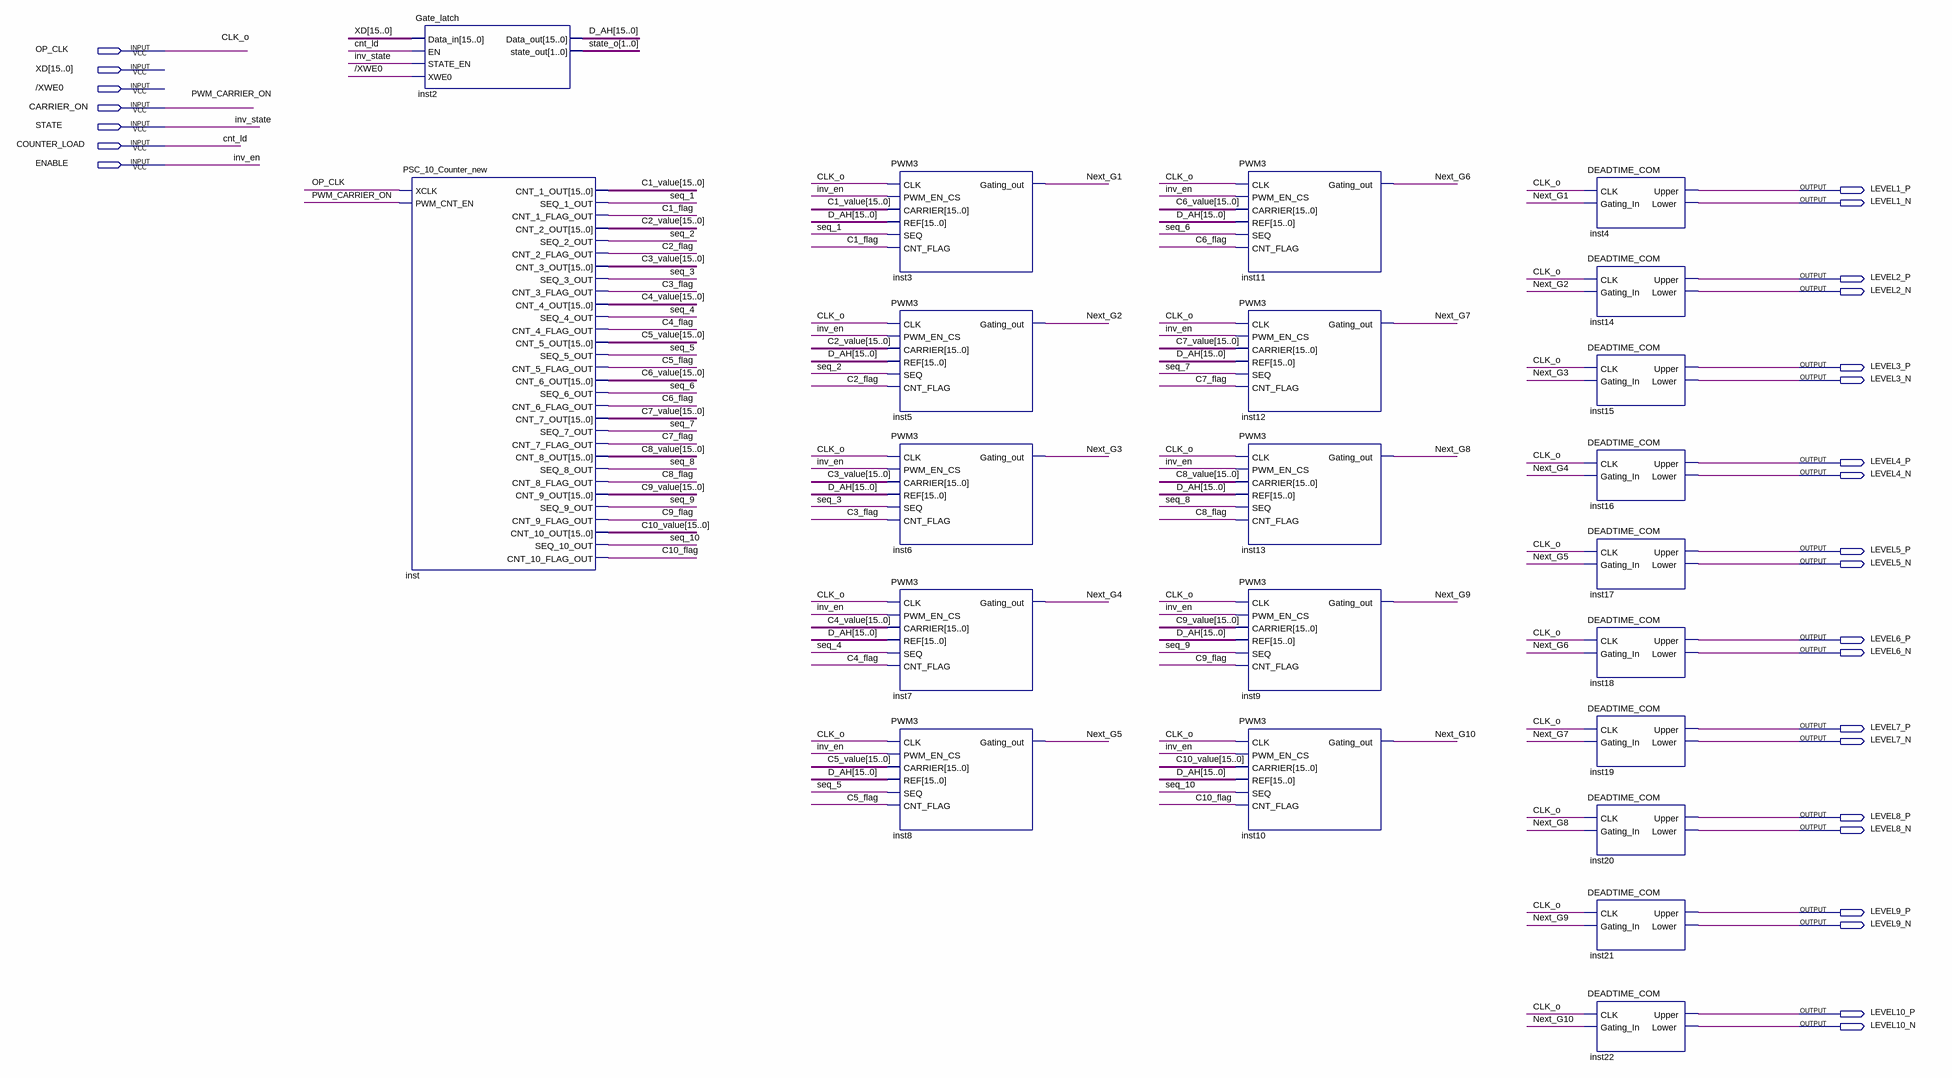
[diagram p0: schematic sheet]
// Quartus schematic INVERTER_LEVEL1.bdf as structural Verilog: 22 symbols, 27 pins
module INVERTER_LEVEL1 (
  input  OP_CLK,
  input  [15:0] XD,
  input  \/XWE0 ,
  input  CARRIER_ON,
  input  STATE,
  input  COUNTER_LOAD,
  input  ENABLE,
  output LEVEL1_P,
  output LEVEL1_N,
  output LEVEL2_P,
  output LEVEL2_N,
  output LEVEL3_P,
  output LEVEL3_N,
  output LEVEL4_P,
  output LEVEL4_N,
  output LEVEL5_P,
  output LEVEL5_N,
  output LEVEL6_P,
  output LEVEL6_N,
  output LEVEL7_P,
  output LEVEL7_N,
  output LEVEL8_P,
  output LEVEL8_N,
  output LEVEL9_P,
  output LEVEL9_N,
  output LEVEL10_P,
  output LEVEL10_N
);

  wire C1_flag, C2_flag, C3_flag, C4_flag, C5_flag, C6_flag, C7_flag, C8_flag, C9_flag, C10_flag, Next_G1,
       Next_G2, Next_G3, Next_G4, Next_G5, Next_G6, Next_G7, Next_G8, Next_G9, Next_G10, seq_1, seq_2, seq_3,
       seq_4, seq_5, seq_6, seq_7, seq_8, seq_9, seq_10;
  wire [1:0] state_o;
  wire [15:0] C1_value, C2_value, C3_value, C4_value, C5_value, C6_value, C7_value, C8_value, C9_value,
       C10_value, D_AH;

  Gate_latch inst2 (
    .Data_in(XD), .EN(COUNTER_LOAD), .STATE_EN(STATE), .XWE0(\/XWE0 ), .Data_out(D_AH), .state_out(state_o));
  PSC_10_Counter_new inst (
    .XCLK(OP_CLK), .PWM_CNT_EN(CARRIER_ON), .CNT_1_OUT(C1_value), .SEQ_1_OUT(seq_1),
    .CNT_1_FLAG_OUT(C1_flag), .CNT_2_OUT(C2_value), .SEQ_2_OUT(seq_2), .CNT_2_FLAG_OUT(C2_flag),
    .CNT_3_OUT(C3_value), .SEQ_3_OUT(seq_3), .CNT_3_FLAG_OUT(C3_flag), .CNT_4_OUT(C4_value),
    .SEQ_4_OUT(seq_4), .CNT_4_FLAG_OUT(C4_flag), .CNT_5_OUT(C5_value), .SEQ_5_OUT(seq_5),
    .CNT_5_FLAG_OUT(C5_flag), .CNT_6_OUT(C6_value), .SEQ_6_OUT(seq_6), .CNT_6_FLAG_OUT(C6_flag),
    .CNT_7_OUT(C7_value), .SEQ_7_OUT(seq_7), .CNT_7_FLAG_OUT(C7_flag), .CNT_8_OUT(C8_value),
    .SEQ_8_OUT(seq_8), .CNT_8_FLAG_OUT(C8_flag), .CNT_9_OUT(C9_value), .SEQ_9_OUT(seq_9),
    .CNT_9_FLAG_OUT(C9_flag), .CNT_10_OUT(C10_value), .SEQ_10_OUT(seq_10), .CNT_10_FLAG_OUT(C10_flag));
  PWM3 inst3 (
    .CLK(OP_CLK), .PWM_EN_CS(ENABLE), .CARRIER(C1_value), .REF(D_AH), .SEQ(seq_1), .CNT_FLAG(C1_flag),
    .Gating_out(Next_G1));
  PWM3 inst5 (
    .CLK(OP_CLK), .PWM_EN_CS(ENABLE), .CARRIER(C2_value), .REF(D_AH), .SEQ(seq_2), .CNT_FLAG(C2_flag),
    .Gating_out(Next_G2));
  PWM3 inst6 (
    .CLK(OP_CLK), .PWM_EN_CS(ENABLE), .CARRIER(C3_value), .REF(D_AH), .SEQ(seq_3), .CNT_FLAG(C3_flag),
    .Gating_out(Next_G3));
  PWM3 inst7 (
    .CLK(OP_CLK), .PWM_EN_CS(ENABLE), .CARRIER(C4_value), .REF(D_AH), .SEQ(seq_4), .CNT_FLAG(C4_flag),
    .Gating_out(Next_G4));
  PWM3 inst8 (
    .CLK(OP_CLK), .PWM_EN_CS(ENABLE), .CARRIER(C5_value), .REF(D_AH), .SEQ(seq_5), .CNT_FLAG(C5_flag),
    .Gating_out(Next_G5));
  PWM3 inst11 (
    .CLK(OP_CLK), .PWM_EN_CS(ENABLE), .CARRIER(C6_value), .REF(D_AH), .SEQ(seq_6), .CNT_FLAG(C6_flag),
    .Gating_out(Next_G6));
  PWM3 inst12 (
    .CLK(OP_CLK), .PWM_EN_CS(ENABLE), .CARRIER(C7_value), .REF(D_AH), .SEQ(seq_7), .CNT_FLAG(C7_flag),
    .Gating_out(Next_G7));
  PWM3 inst13 (
    .CLK(OP_CLK), .PWM_EN_CS(ENABLE), .CARRIER(C8_value), .REF(D_AH), .SEQ(seq_8), .CNT_FLAG(C8_flag),
    .Gating_out(Next_G8));
  PWM3 inst9 (
    .CLK(OP_CLK), .PWM_EN_CS(ENABLE), .CARRIER(C9_value), .REF(D_AH), .SEQ(seq_9), .CNT_FLAG(C9_flag),
    .Gating_out(Next_G9));
  PWM3 inst10 (
    .CLK(OP_CLK), .PWM_EN_CS(ENABLE), .CARRIER(C10_value), .REF(D_AH), .SEQ(seq_10), .CNT_FLAG(C10_flag),
    .Gating_out(Next_G10));
  DEADTIME_COM inst4 (.CLK(OP_CLK), .Gating_In(Next_G1), .Upper(LEVEL1_P), .Lower(LEVEL1_N));
  DEADTIME_COM inst14 (.CLK(OP_CLK), .Gating_In(Next_G2), .Upper(LEVEL2_P), .Lower(LEVEL2_N));
  DEADTIME_COM inst15 (.CLK(OP_CLK), .Gating_In(Next_G3), .Upper(LEVEL3_P), .Lower(LEVEL3_N));
  DEADTIME_COM inst16 (.CLK(OP_CLK), .Gating_In(Next_G4), .Upper(LEVEL4_P), .Lower(LEVEL4_N));
  DEADTIME_COM inst17 (.CLK(OP_CLK), .Gating_In(Next_G5), .Upper(LEVEL5_P), .Lower(LEVEL5_N));
  DEADTIME_COM inst18 (.CLK(OP_CLK), .Gating_In(Next_G6), .Upper(LEVEL6_P), .Lower(LEVEL6_N));
  DEADTIME_COM inst19 (.CLK(OP_CLK), .Gating_In(Next_G7), .Upper(LEVEL7_P), .Lower(LEVEL7_N));
  DEADTIME_COM inst20 (.CLK(OP_CLK), .Gating_In(Next_G8), .Upper(LEVEL8_P), .Lower(LEVEL8_N));
  DEADTIME_COM inst21 (.CLK(OP_CLK), .Gating_In(Next_G9), .Upper(LEVEL9_P), .Lower(LEVEL9_N));
  DEADTIME_COM inst22 (.CLK(OP_CLK), .Gating_In(Next_G10), .Upper(LEVEL10_P), .Lower(LEVEL10_N));

  // Other names for the same wires on the sheet: CLK_o = OP_CLK; cnt_ld = COUNTER_LOAD; inv_en = ENABLE;
  //   inv_state = STATE; PWM_CARRIER_ON = CARRIER_ON
endmodule
